# EAGLE schematic clockWiring (EAGLE 9.6.2)
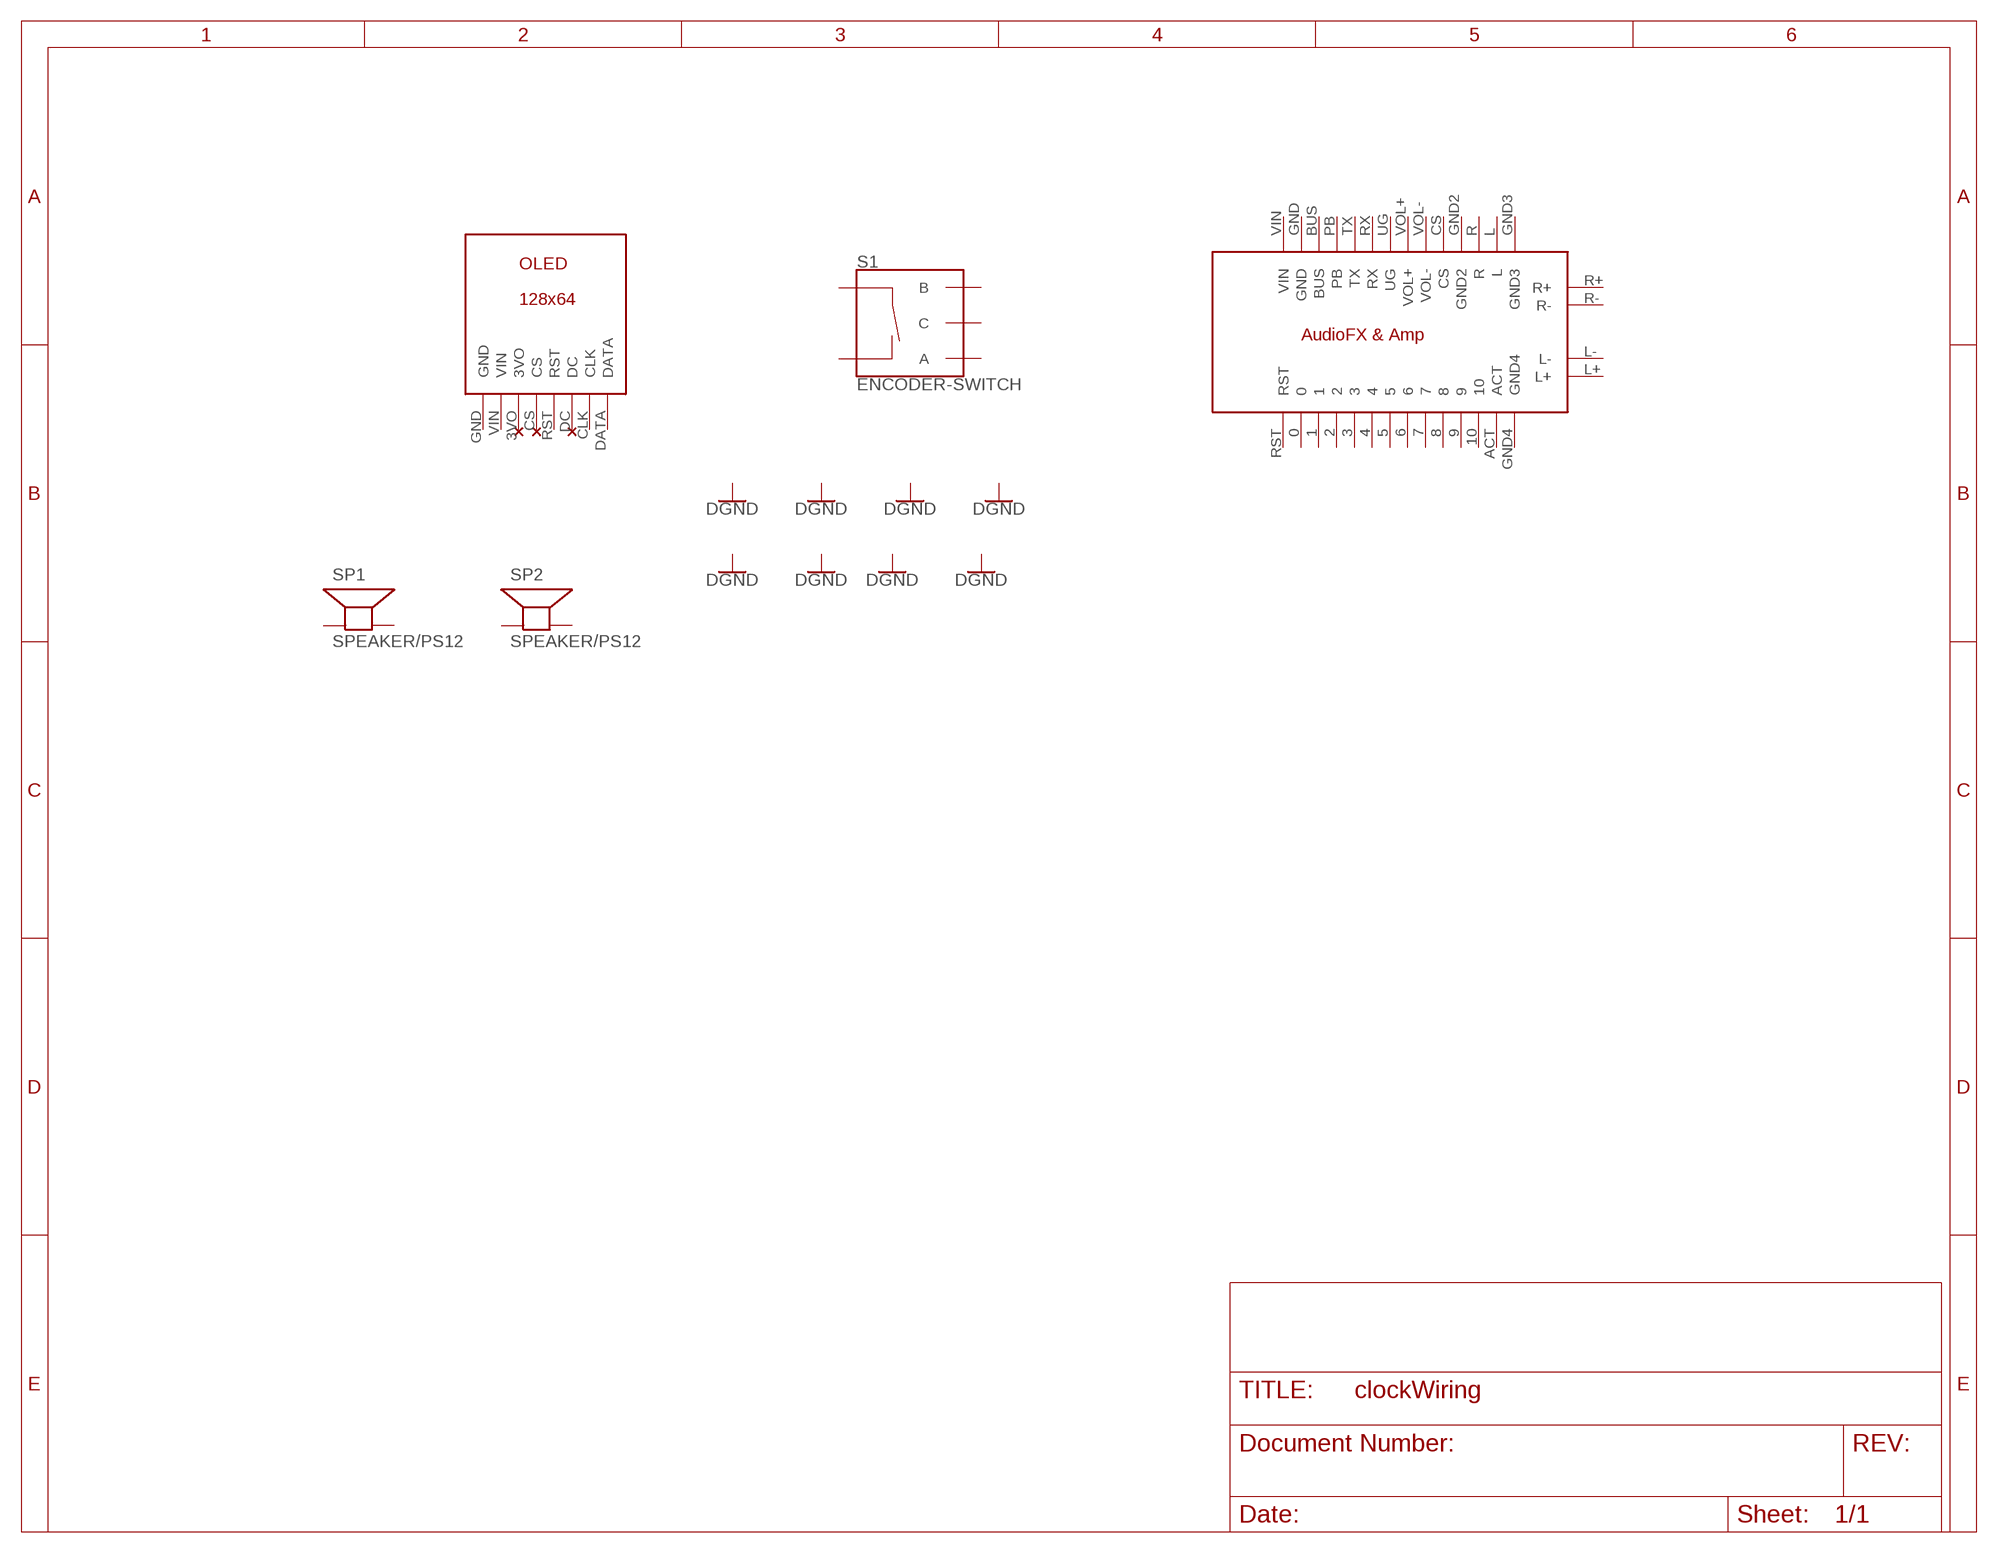
[diagram p0: schematic, sheet 1]

## Parts
S1  ENCODER-SWITCH  [ROTARY_ENC_PLAIN]
SP1  SPEAKER/PS12  [PS12]
SP2  SPEAKER/PS12  [PS12]
U$2  OLED_128X64  [OLED_128X64]
U$5  AUDIOFX&AMP  [AUDIOFX&AMP]
Unconnected: S1.A S1.B S1.C S1.SW+ S1.SW- SP1.P$1(+) SP1.P$2(-) SP2.P$1(+) SP2.P$2(-) U$2.3VO U$2.CLK U$2.CS U$2.DATA U$2.DC U$2.GND U$2.RST U$2.VIN U$5.0 U$5.1 U$5.2 U$5.3 U$5.4 U$5.5 U$5.6 U$5.7 U$5.8 U$5.9 U$5.10 U$5.ACT U$5.BUS U$5.CS U$5.GND U$5.GND2 U$5.GND3 U$5.GND4 U$5.L U$5.L+ U$5.L- U$5.PB U$5.R U$5.R+ U$5.R- U$5.RST U$5.RX U$5.TX U$5.UG U$5.VIN U$5.VOL+ U$5.VOL-

## Library data of the parts
S1 = SparkFun-Switches:ENCODER-SWITCH: Rotary Encoder w/ Select Switch Encoders rotate similarly to potentiometers, but they’re different from potentiometers in that an encoder has full rotation without limits. They output gray code so that you can tell how much and in which direction the encoder has been turned. This encoder includes a push-down select switch built into the shaft. SparkFun Products Rotary Encoder <https://www.sparkfun.com/products/9117> (COM-09117); SF_SKU: COM-09117
SP1 SP2 = adafruit:SPEAKER: SPEAKER Source: Buerklin Added PS12 (for part # PS1240 piezo) http://www.ladyada.net/library/pcb/eaglelibrary.html
U$2 = OLED_128x64:OLED_128X64
U$5 = audioFX&Amp:AUDIOFX&AMP